# Altium schematic sheet [2]Microcontroller.SchDoc
size A
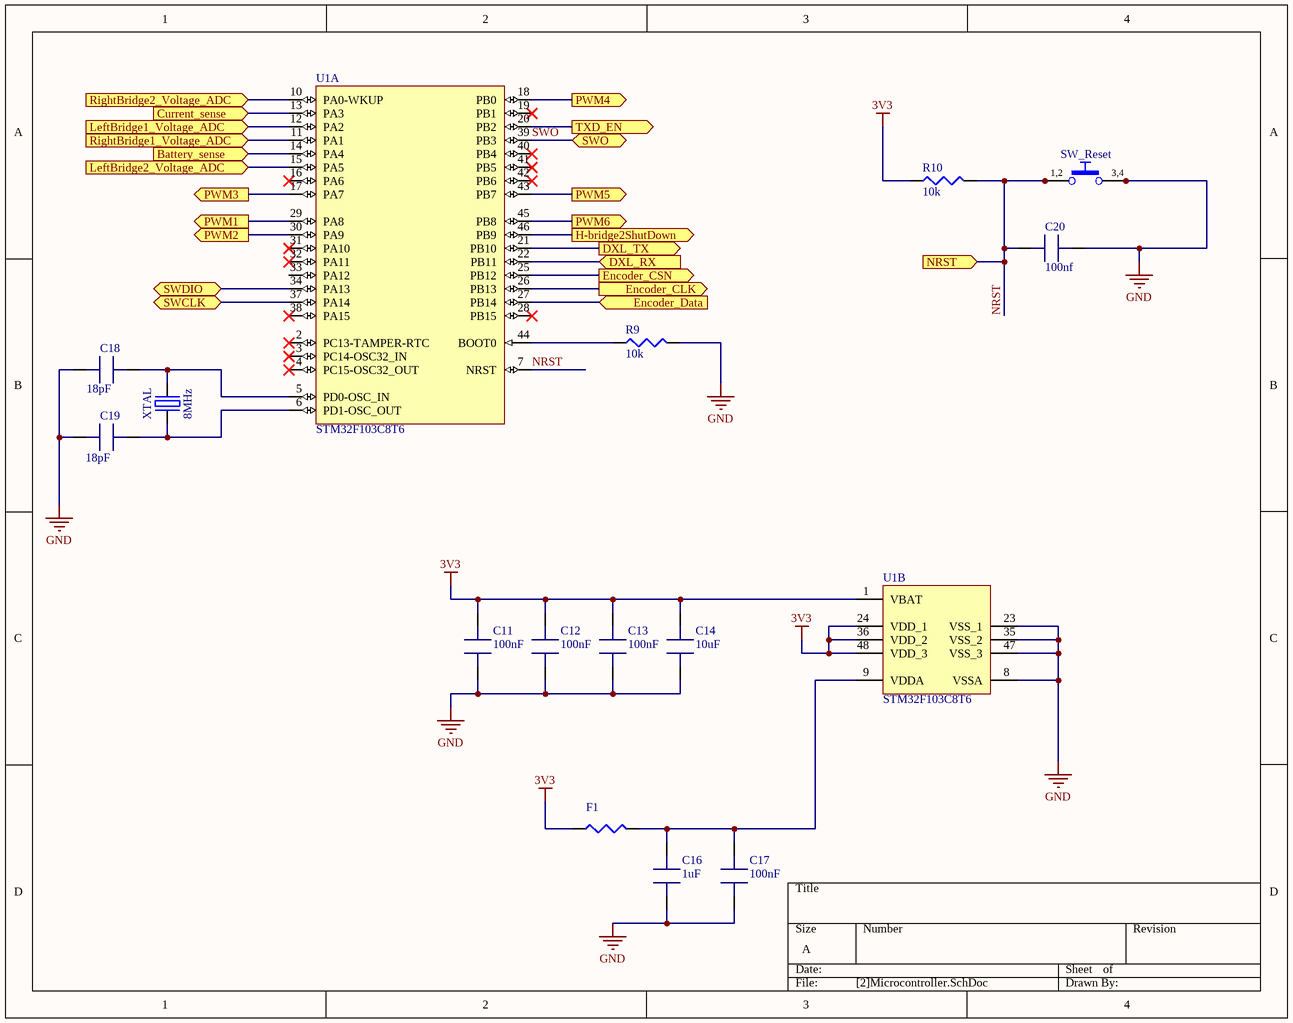
[diagram p0: [2]Microcontroller.SchDoc]

## Parts
C11  100nF  [cap_805]
C12  100nF  [cap_805]
C13  100nF  [cap_805]
C14  10uF  [cap_805]
C16  1uF  [cap_805]
C17  100nF  [cap_805]
C18  18pF  [cap_805]
C19  18pF  [cap_805]
C20  100nf  [cap_805]
F1  Res805  [Res805]  (value not drawn)
R9  10k  [Res805]
R10  10k  [Res805]
SW_Reset  Push Button  [PB_OMRON_B3F-1000]  (value not drawn)
U1  STM32F103C8T6  [STM-LQFP48_N]  (parts A,B of 2)
XTAL  8MHz  [XTAL_HC-49/U]

## Ports
Battery_sense (in), Current_sense (in), DXL_RX (in), DXL_TX (out), Encoder_CLK (out), Encoder_CSN (out), Encoder_Data (in), H-bridge2ShutDown (out), LeftBridge1_Voltage_ADC (in), LeftBridge2_Voltage_ADC (in), NRST (in), PWM1 (out), PWM2 (out), PWM3 (out), PWM4 (out), PWM5 (out), PWM6 (out), RightBridge1_Voltage_ADC (in), RightBridge2_Voltage_ADC (in), SWCLK, SWDIO (bidir), SWO (bidir), TXD_EN (out)

## Nets
3V3: C11.2 C12.2 C13.2 C14.2 F1.1 R10.1 U1.1(VBAT) U1.24(VDD_1) U1.36(VDD_2) U1.48(VDD_3)
GND: C11.1 C12.1 C13.1 C14.1 C16.1 C17.1 C18.1 C19.1 C20.2 R9.2 SW_Reset.3 SW_Reset.4 U1.8(VSSA) U1.23(VSS_1) U1.35(VSS_2) U1.47(VSS_3)
Battery_sense: U1.14(PA4) ; port Battery_sense
Current_sense: U1.13(PA3) ; port Current_sense
DXL_RX: U1.22(PB11) ; port DXL_RX
DXL_TX: U1.21(PB10) ; port DXL_TX
Encoder_CLK: U1.26(PB13) ; port Encoder_CLK
Encoder_CSN: U1.25(PB12) ; port Encoder_CSN
Encoder_Data: U1.27(PB14) ; port Encoder_Data
H-bridge2ShutDown: U1.46(PB9) ; port H-bridge2ShutDown
LeftBridge1_Voltage_ADC: U1.12(PA2) ; port LeftBridge1_Voltage_ADC
LeftBridge2_Voltage_ADC: U1.15(PA5) ; port LeftBridge2_Voltage_ADC
NRST: C20.1 R10.2 SW_Reset.1 SW_Reset.2 U1.7(NRST) ; port NRST
PWM1: U1.29(PA8) ; port PWM1
PWM2: U1.30(PA9) ; port PWM2
PWM3: U1.17(PA7) ; port PWM3
PWM4: U1.18(PB0) ; port PWM4
PWM5: U1.43(PB7) ; port PWM5
PWM6: U1.45(PB8) ; port PWM6
RightBridge1_Voltage_ADC: U1.11(PA1) ; port RightBridge1_Voltage_ADC
RightBridge2_Voltage_ADC: U1.10(PA0-WKUP) ; port RightBridge2_Voltage_ADC
SWCLK: U1.37(PA14) ; port SWCLK
SWDIO: U1.34(PA13) ; port SWDIO
SWO: U1.39(PB3) ; port SWO
TXD_EN: U1.20(PB2) ; port TXD_EN
NetC16_2: C16.2 C17.2 F1.2 U1.9(VDDA)
NetC18_2: C18.2 U1.5(PD0-OSC_IN) XTAL.2(OSC2)
NetC19_2: C19.2 U1.6(PD1-OSC_OUT) XTAL.1(OSC1)
NetR9_1: R9.1 U1.44(BOOT0)

Not connected (* = marked no-connect by the designer): U1 2(PC13-TAMPER-RTC)* 3(PC14-OSC32_IN)* 4(PC15-OSC32_OUT)* 16(PA6)* 19(PB1)* 28(PB15)* 31(PA10)* 32(PA11)* 33(PA12) 38(PA15)* 40(PB4)* 41(PB5)* 42(PB6)*

## Notes on the sheet
- (in symbol PB_OMRON_B3F-1000) 1,2; 3,4

## Library data of the parts
C11-C14 C16-C20 = cap805
R9 R10 = Res805
SW_Reset = PB_OMRON_B3F-1000: Push-Button Switch SPDT; Part Description: 24VDC 50mA SPST-NO Tactile Push-Button Switch (h=4.5mm); Manufacturer: OMRON; Table: Switches; Part Number: PB_OMRON_B3F-1000; Component Kind: Standard; Component Type: Standard; Pin Count: 4; PackageDescription: 6x6mm Model, Horizontal, Flat Plunger Type (without Ground Terminal) Pushbutton Switch, OMRON B3F Series; Family: Push Button; Mounted: Yes; Socket: No; SMD: No; Status: None; Manufacturer Part Number: B3F-1000; ComponentHeight: 4.5mm; HelpURL: \\cern.ch\dfs\Applications\Altium\Datasheets\PB_OMRON_B3F-1000.pdf; Author: CERN DEM JMW; CreateDate: 10/23/2008; LatestRevisionDate: 5/6/2009
U1 = STM32F103C8T6: ARM Cortex-M3 32-bit MCU, 64 KB Flash, 20 KB Internal RAM, 37 I/Os, 48-pin LQFP, -40 to 85 degC, Tray; A/D Converter: 2x12-bit (10 Channel); FLASH Size (Prog) (kB): 64; I/Os (High Current): 37; Internal RAM Size (kB): 20; Operating Frequency(F) (Processor speed) (MHz): 72; Supply Voltage(Vcc) min (V): 2; DatasheetVersion: Rev. 16; PackageVersion: Rev. 6, 06/2013; PackageReference: LQFP48; PackageDescription: 48-Pin Low Profile Quad Flat Package, 7 x 7 mm Body, 0.5 mm Pitch; Supplier 1: Digi-Key; Supplier Part Number 1: 497-6063-ND; Supplier 2: Farnell; Supplier Part Number 2: 1447637; Supplier 3: Newark; Supplier Part Number 3: 59M2182; Supplier 4: Newark; Supplier Part Number 4: 57P1222; Supplier 5: Mouser; Supplier Part Number 5: 511-STM32F103C8T6; Core: ARM Cortex-M3; Packing: Tray; Mounting Technology: Surface Mount; PartNumber: STM32F103C8T6; ComponentLink1Description: Manufacturer URL; ComponentLink1URL: http://www.st.com/web/en/home.html; ComponentLink2Description: Datasheet; ComponentLink2URL: http://www.st.com/st-web-ui/static/active/en/resource/technical/document/datasheet/CD00161566.pdf; ComponentLink3Description: Package Specification; ComponentLink3URL: http://www.st.com/st-web-ui/static/active/en/resource/technical/document/datasheet/DM00058181.pdf
XTAL = XTAL_20MHZ_AEL_HC-49/U: Quartz Crystal; Part Description: ±30ppm Quartz Crystal Resonator, HC-49/U Type; Manufacturer: AEL CRYSTALS; Manufacturer Part Number: X20M000000L010; Value: 20MHz; Table: Crystals & Oscillators; Part Number: XTAL_20MHZ_AEL_HC-49/U; Component Kind: Standard; Component Type: Standard; PackageDescription: HC-49/U Leaded Cristal, Body 11.05x4.8mm; Pitch 4.88mm; Pin Count: 2; Mounted: Yes; Socket: No; SMD: No; ComponentHeight: 13.6mm; HelpURL: \\cern.ch\dfs\Applications\Altium\Datasheets\XTAL_AEL_HC-49-U.pdf; Author: CERN DEM JMW; CreateDate: 10/31/2008; LatestRevisionDate: 5/13/2011